# EAGLE design relay2 (EAGLE 5.09)
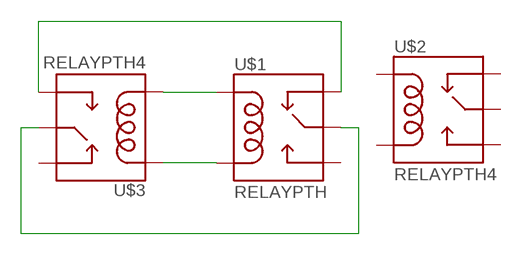
[diagram p0: schematic, sheet 1]

## Parts
U$1  RELAYPTH  [RELAY-G5Q]
U$2  RELAYPTH4  [RELAY-JZC]
U$3  RELAYPTH4  [RELAY-JZC]

## Nets
N$1: U$1.5(COIL1) U$3.1(COIL2)
N$2: U$1.1(COIL2) U$3.5(COIL1)
N$3: U$1.4(NC) U$3.3(NO)
N$4: U$1.2(MAIN) U$3.4(MAIN)
Unconnected: U$1.3(NO) U$2.1(COIL2) U$2.2(NC) U$2.3(NO) U$2.4(MAIN) U$2.5(COIL1) U$3.2(NC)

## Library data of the parts
U$1-U$3 = SparkFun:RELAY

## Board
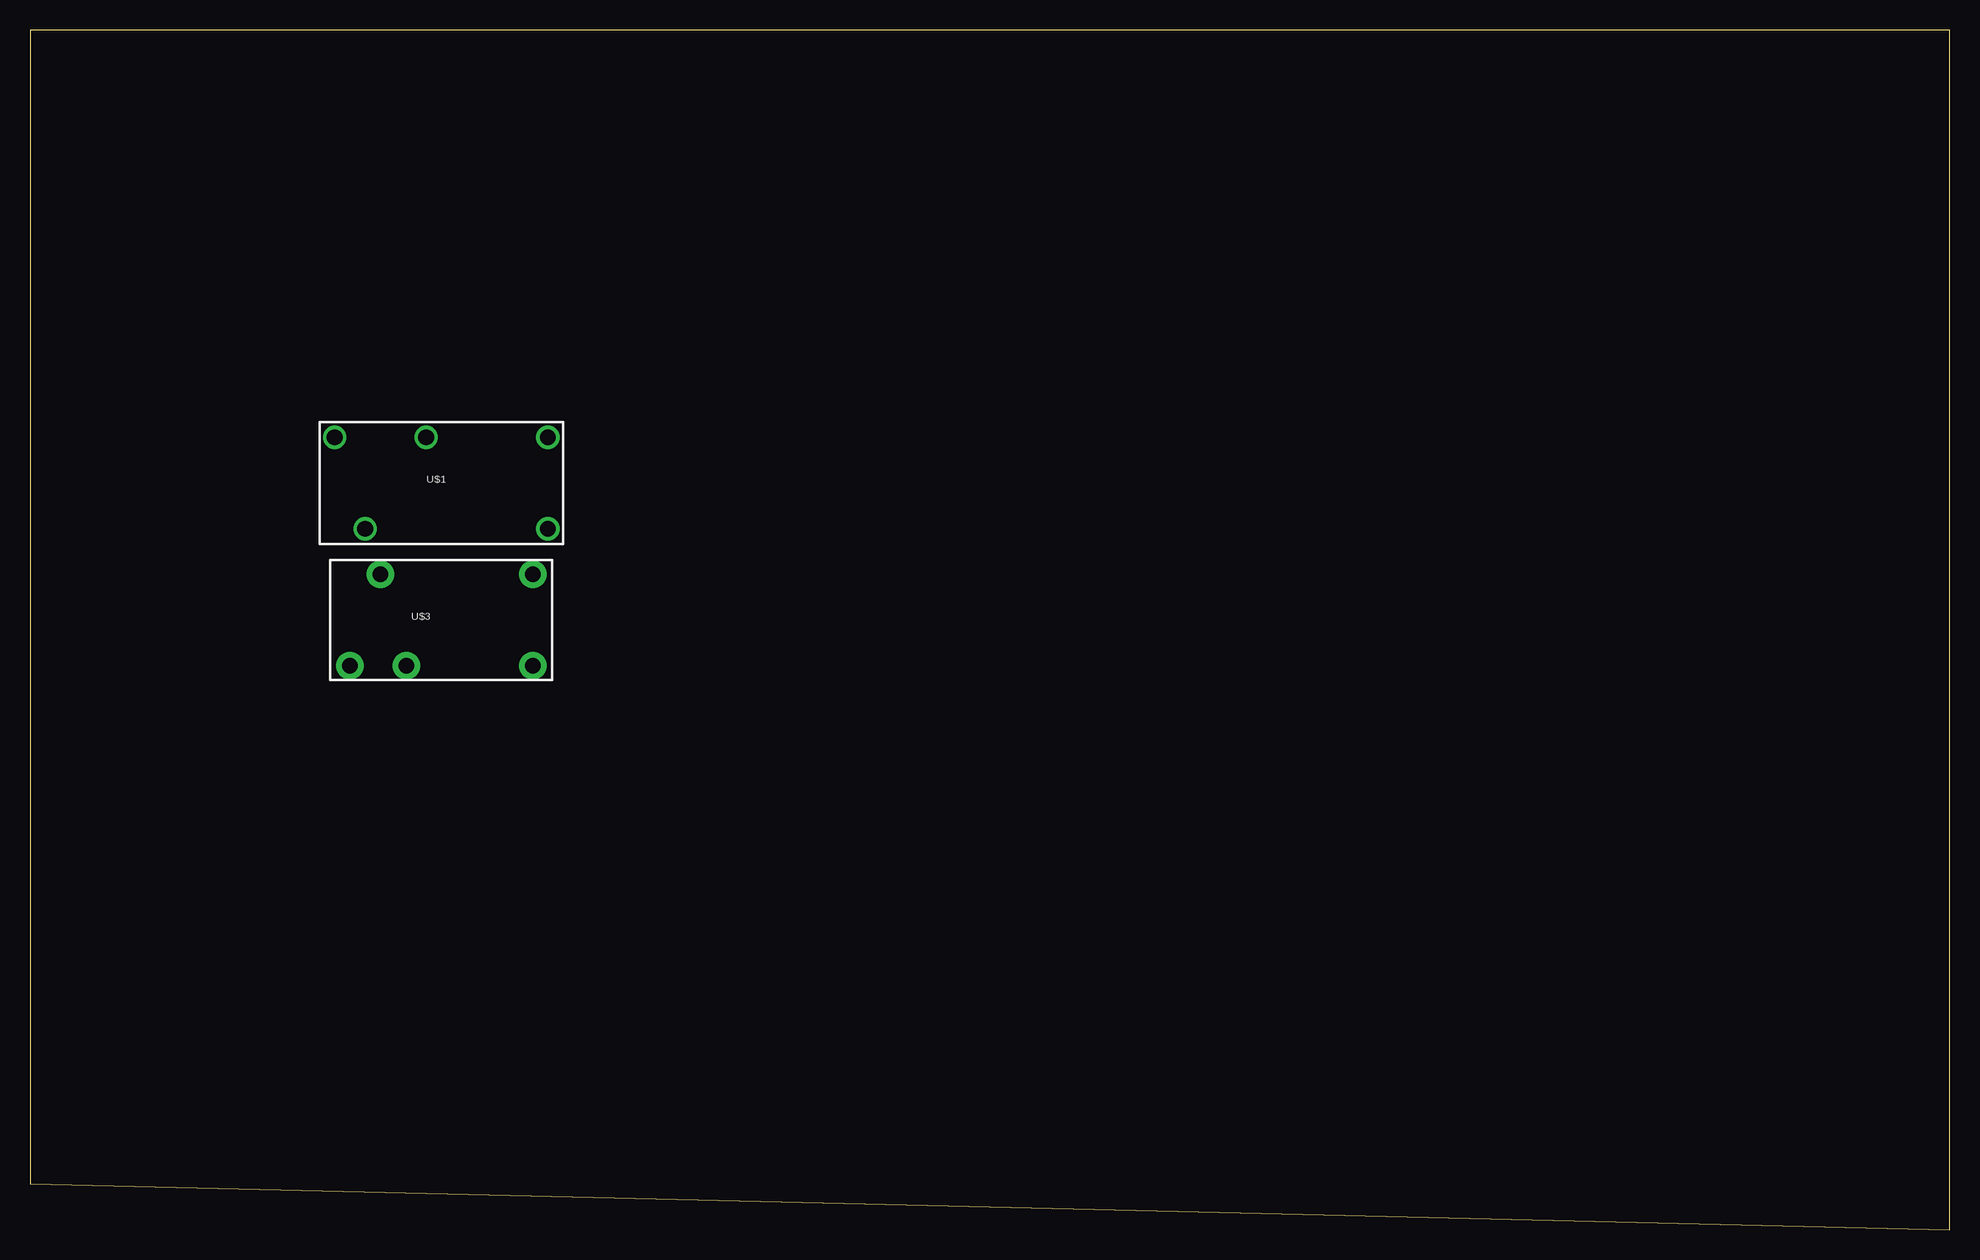
[diagram p1: board, top side]
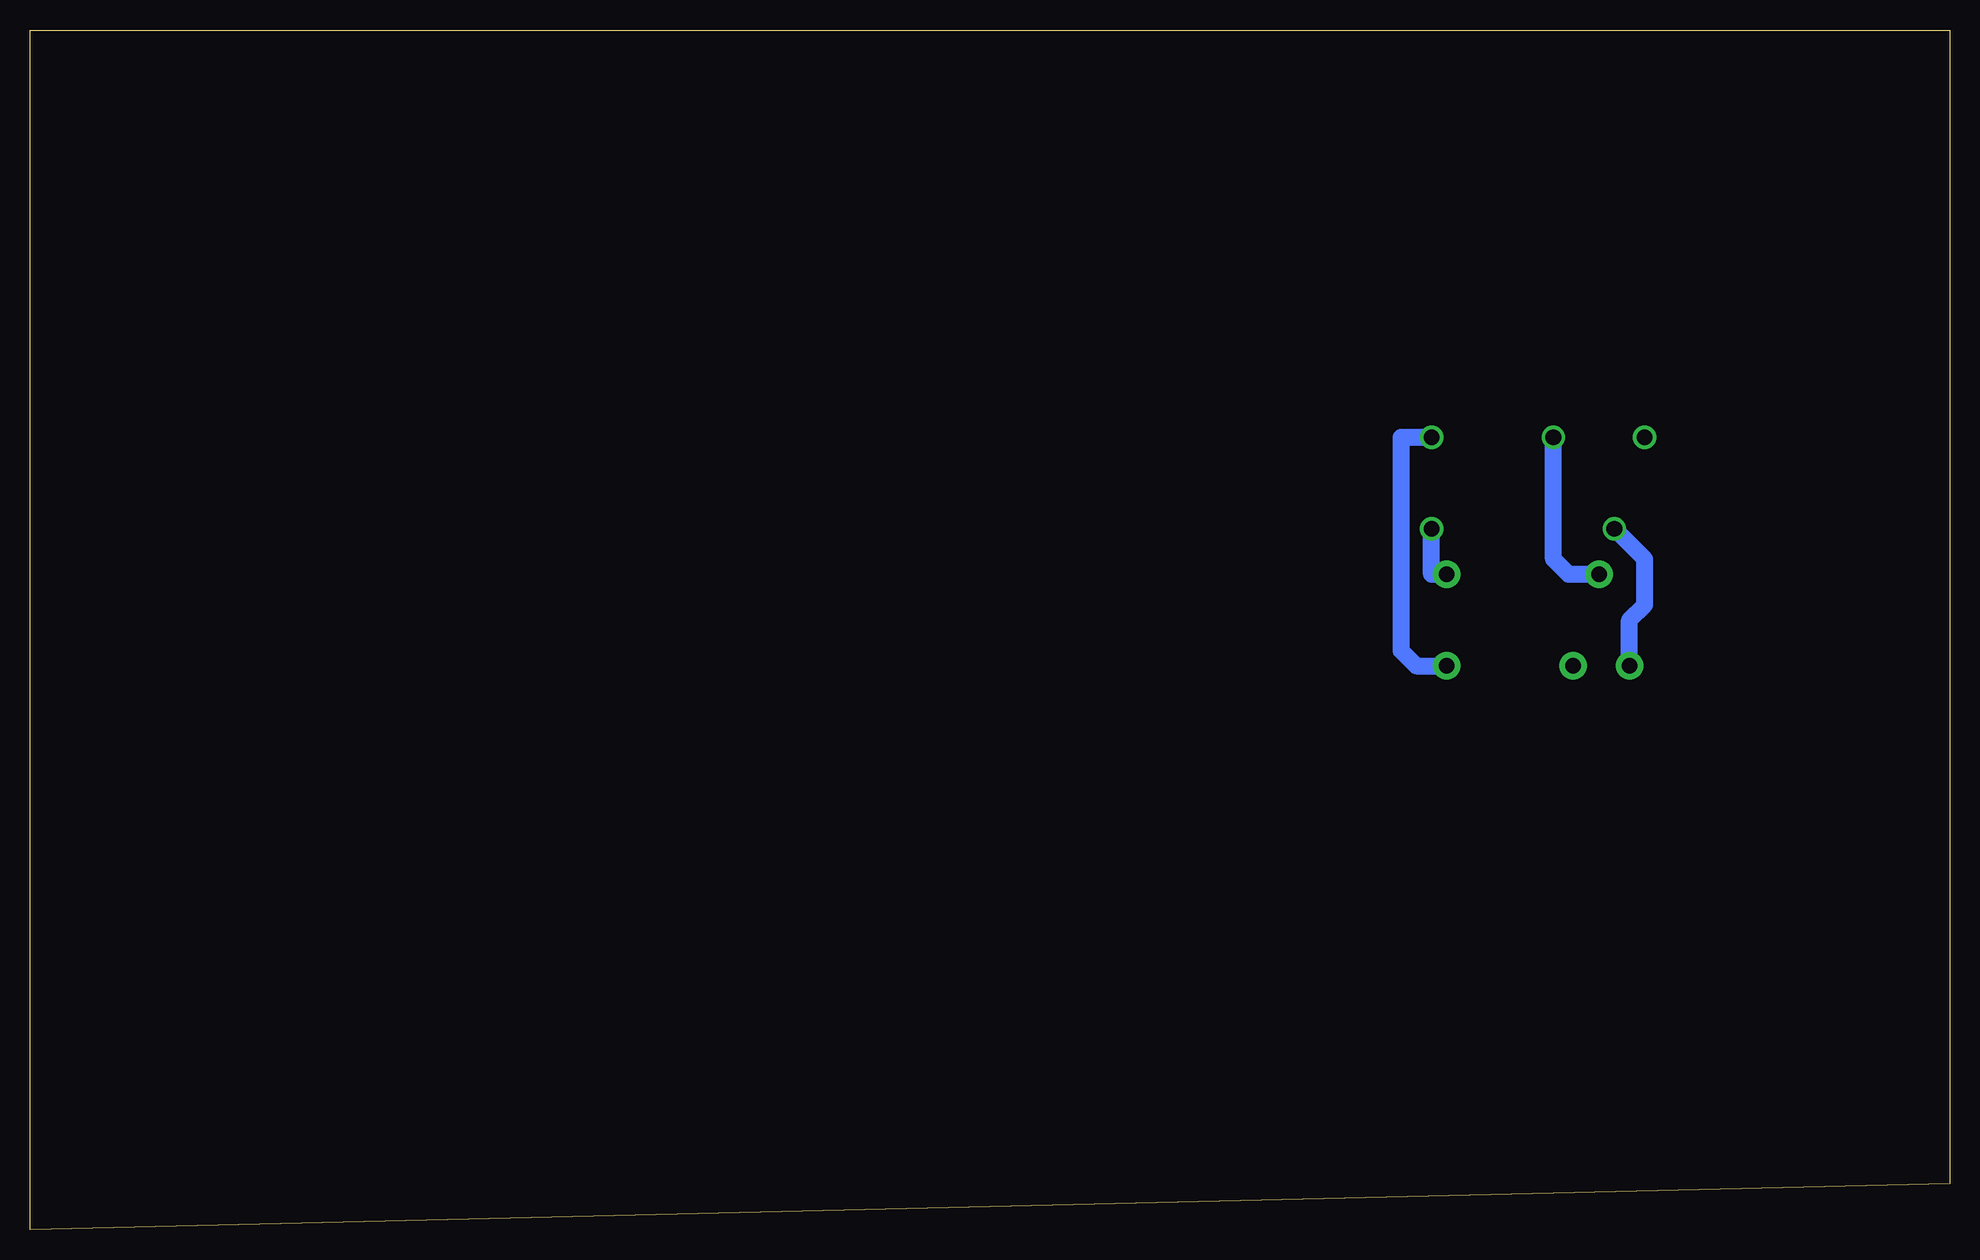
[diagram p2: board, bottom side, seen from below]

Size 160 x 100 mm. Coordinates in mm from the lower left corner, seen from the top.
Outline: 0,3.81 160,0 160,100 0,100 0,3.81
Copper layers (1*16): Top 0.035mm / dielectric 1.5mm / Bottom 0.035mm
Design rules "default": minimum track width 10mil, minimum drill 24mil, track to track 8mil, track to pad 8mil, pad to pad 8mil, via to via 8mil, smd to smd 8mil, copper to edge 40mil, drill to drill 8mil, minimum pad ring 10mil, minimum via ring 8mil, stop-mask expansion 4mil, vias tented up to drill 0mil, thermal gap 10mil

### Footprints (pad centres in the part's own frame; a part is rotated, then mirrored left to right if it is on the bottom)
RELAY-G5Q = drill 1.3 round: 1 8.89,3.81; 2 -1.27,3.81; 3 -8.89,3.81; 4 -6.35,-3.81; 5 8.89,-3.81
RELAY-JZC = drill 1.3 pad 2.286 round: 1 3.81,-8.89; 2 -3.81,1.651; 3 -3.81,6.35; 4 3.81,3.81; 5 -3.81,-8.89

### Placement (x,y rotation side)
U$1  34.29,62.23 0 top
U$3  33.02,50.8 90 top

### Tracks (layer width: path | path; a pad name or v marks a point on that pad's centre or on a via)
N$1
  Bottom 1.422: U$3.1 43.18,54.61 U$1.5
N$2
  Bottom 1.422: U$1.1 45.72,66.04 45.72,48.26 44.45,46.99 U$3.5
N$3
  Bottom 1.422: U$3.3 26.67,50.8 25.4,52.07 25.4,55.88 U$1.4
N$4
  Bottom 1.422: U$3.4 31.75,54.61 33.02,55.88 U$1.2